# Altium schematic sheet Mother Board USB.SchDoc
size A4
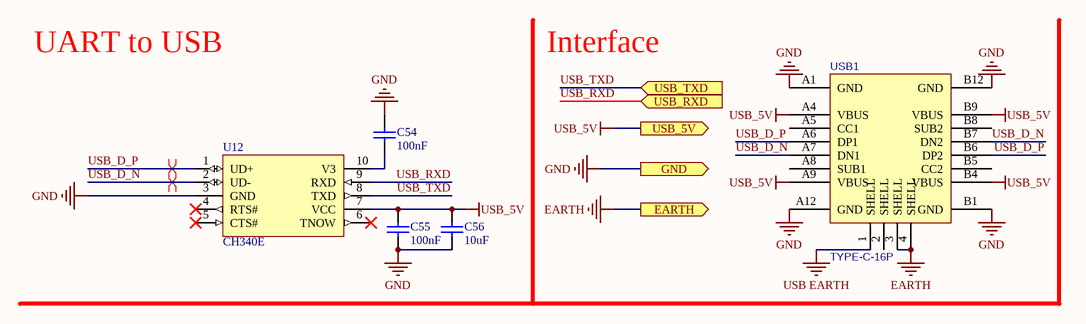
[diagram p0: Mother Board USB.SchDoc]

## Parts
C54  100nF  [C0603]
C55  100nF  [C0603]
C56  10uF  [C0603]
U12  CH340E  [MSOP10]
USB1  TYPE-C-16P  [USB-C_16P]

## Ports
EARTH (out), GND (out), USB_5V (out), USB_RXD (in), USB_TXD (in)

## Nets
EARTH: USB1.3(SHELL) USB1.4(SHELL) ; port EARTH
GND: C54.2 C55.2 C56.2 U12.3(GND) USB1.A1(GND) USB1.A12(GND) USB1.B1(GND) USB1.B12(GND) ; port GND
USB EARTH: USB1.1(SHELL)
USB_5V: C55.1 C56.1 U12.7(VCC) USB1.A4(VBUS) USB1.A9(VBUS) USB1.B4(VBUS) USB1.B9(VBUS) ; port USB_5V
USB_D_N: U12.2(UD-) USB1.A7(DN1) USB1.B7(DN2)
USB_D_P: U12.1(UD+) USB1.A6(DP1) USB1.B6(DP2)
USB_RXD: U12.9(RXD) ; port USB_RXD
USB_TXD: U12.8(TXD) ; port USB_TXD
NetC54_1: C54.1 U12.10(V3)

Not connected (* = marked no-connect by the designer): U12 4(RTS#)* 5(CTS#)* 6(TNOW)*; USB1 2(SHELL) A5(CC1) A8(SUB1) B5(CC2) B8(SUB2)

## Layout directives
differential pair: USB_D_N, USB_D_P

## Notes on the sheet
- UART to USB
- Interface

## Library data of the parts
C54 C55 = Cap_100nF
C56 = Cap
U12 = CH340E: USB to TTL Serial / UART
USB1 = USB-C-16P: BOM_Manufacturer: Shenzhen Kinghelm Elec; BOM_Manufacturer Part: KH-TYPE-C-16P; Contributor: LCSC; BOM_Supplier: LCSC; BOM_Supplier Part: C709357; BOM_JLCPCB Part Class: Extended Part; spicePre: U; spiceSymbolName: KH-TYPE-C-16P